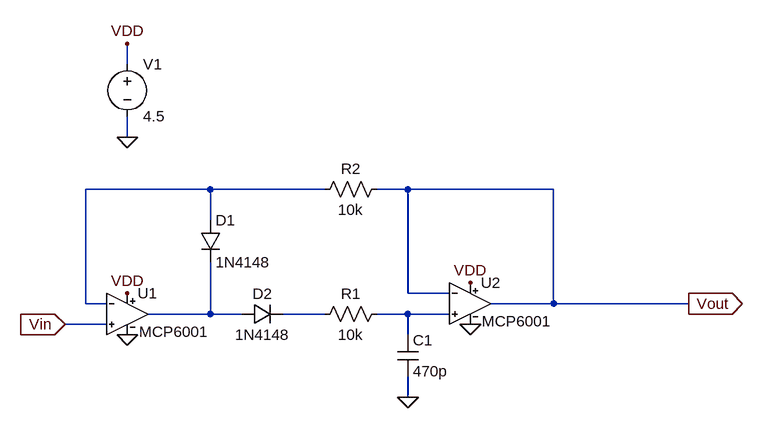
[diagram p0: schematic peak_detector.asc]
peak_detector.asc, the LTspice schematic file:
Version 4
SHEET 1 880 680
WIRE -192 -208 -192 -240
WIRE -192 -96 -192 -128
WIRE -64 -16 -256 -16
WIRE 112 -16 -64 -16
WIRE 240 -16 192 -16
WIRE 464 -16 240 -16
WIRE -64 32 -64 -16
WIRE 240 144 240 -16
WIRE 304 144 240 144
WIRE -256 160 -256 -16
WIRE -224 160 -256 160
WIRE 464 160 464 -16
WIRE 464 160 368 160
WIRE 672 160 464 160
WIRE -64 176 -64 96
WIRE -64 176 -160 176
WIRE -16 176 -64 176
WIRE 112 176 48 176
WIRE 240 176 192 176
WIRE 304 176 240 176
WIRE -224 192 -288 192
WIRE 240 208 240 176
WIRE 240 304 240 272
FLAG 240 304 0
FLAG -288 192 Vin
IOPIN -288 192 In
FLAG -192 144 VDD
FLAG 336 128 VDD
FLAG -192 208 0
FLAG 336 192 0
FLAG 672 160 Vout
IOPIN 672 160 Out
FLAG -192 -96 0
FLAG -192 -240 VDD
SYMBOL diode -80 32 R0
SYMATTR InstName D1
SYMATTR Value 1N4148
SYMBOL diode -16 192 R270
WINDOW 0 32 32 VTop 2
WINDOW 3 0 32 VBottom 2
SYMATTR InstName D2
SYMATTR Value 1N4148
SYMBOL res 208 160 R90
WINDOW 0 0 56 VBottom 2
WINDOW 3 32 56 VTop 2
SYMATTR InstName R1
SYMATTR Value 10k
SYMBOL cap 224 208 R0
SYMATTR InstName C1
SYMATTR Value 470p
SYMBOL res 208 -32 R90
WINDOW 0 0 56 VBottom 2
WINDOW 3 32 56 VTop 2
SYMATTR InstName R2
SYMATTR Value 10k
SYMBOL MCP6001_AB -192 112 R0
SYMATTR InstName U1
SYMBOL MCP6001_AB 336 96 R0
SYMATTR InstName U2
SYMBOL voltage -192 -224 R0
WINDOW 123 0 0 Left 0
WINDOW 39 0 0 Left 0
SYMATTR InstName V1
SYMATTR Value 4.5

The netlist it stands for:
* peak_detector.asc
D1 N001 N002 1N4148
D2 N002 N003 1N4148
R1 N004 N003 10k
C1 N004 0 470p
R2 Vout N001 10k
XU1 Vin N001 VDD 0 N002 MCP6001  ; pins In+ In- V+ V- OUT
XU2 N004 Vout VDD 0 Vout MCP6001  ; pins In+ In- V+ V- OUT
V1 VDD 0 4.5
.model D D
.lib standard.dio
.lib MCP6001.lib
.backanno
.end